# EasyEDA Pro project YanXi_Project.eprj, schematic FlightControlBoard

## Sheets
1 主控: Create Date: 2023-07-10; Page Name: P1; Project Name: KAKUTE_mini; Schematic Name: Schematic1; Update Date: 2023-07-10; Company: 嘉立创EDA; Page Size: A4; Version: V1.0
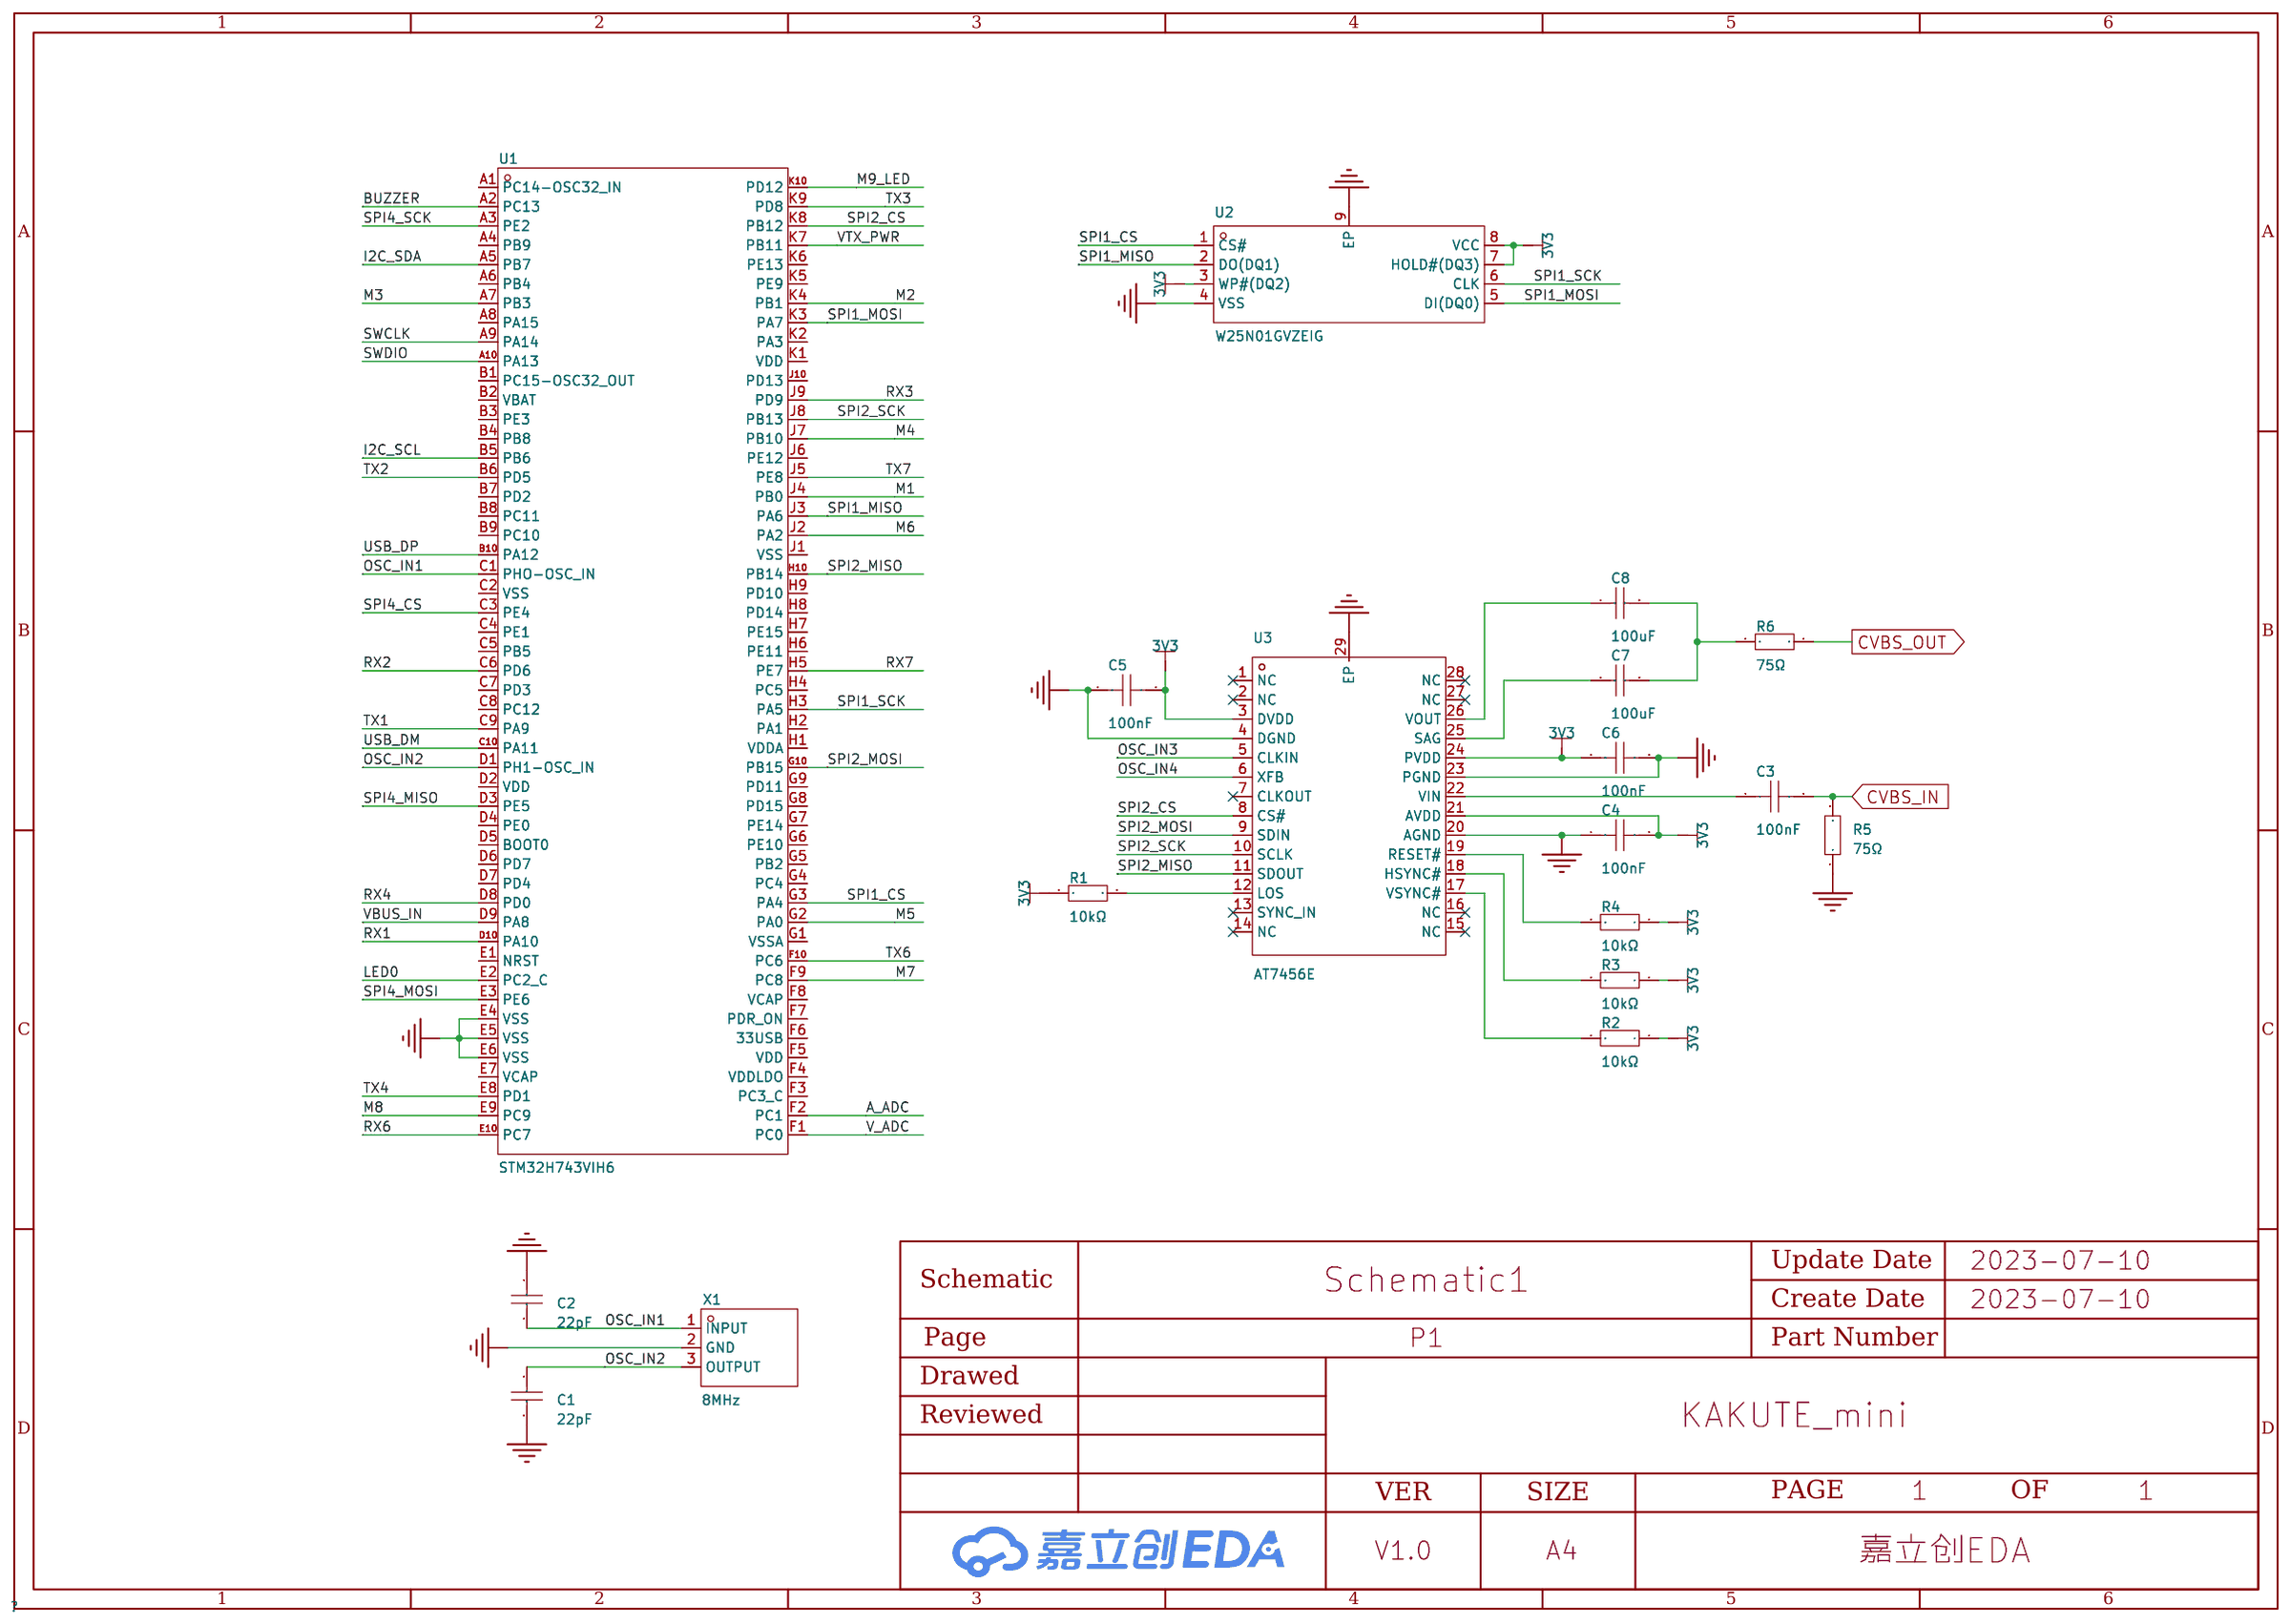
[diagram p3: 主控]
2 接插件: Page Name: P2
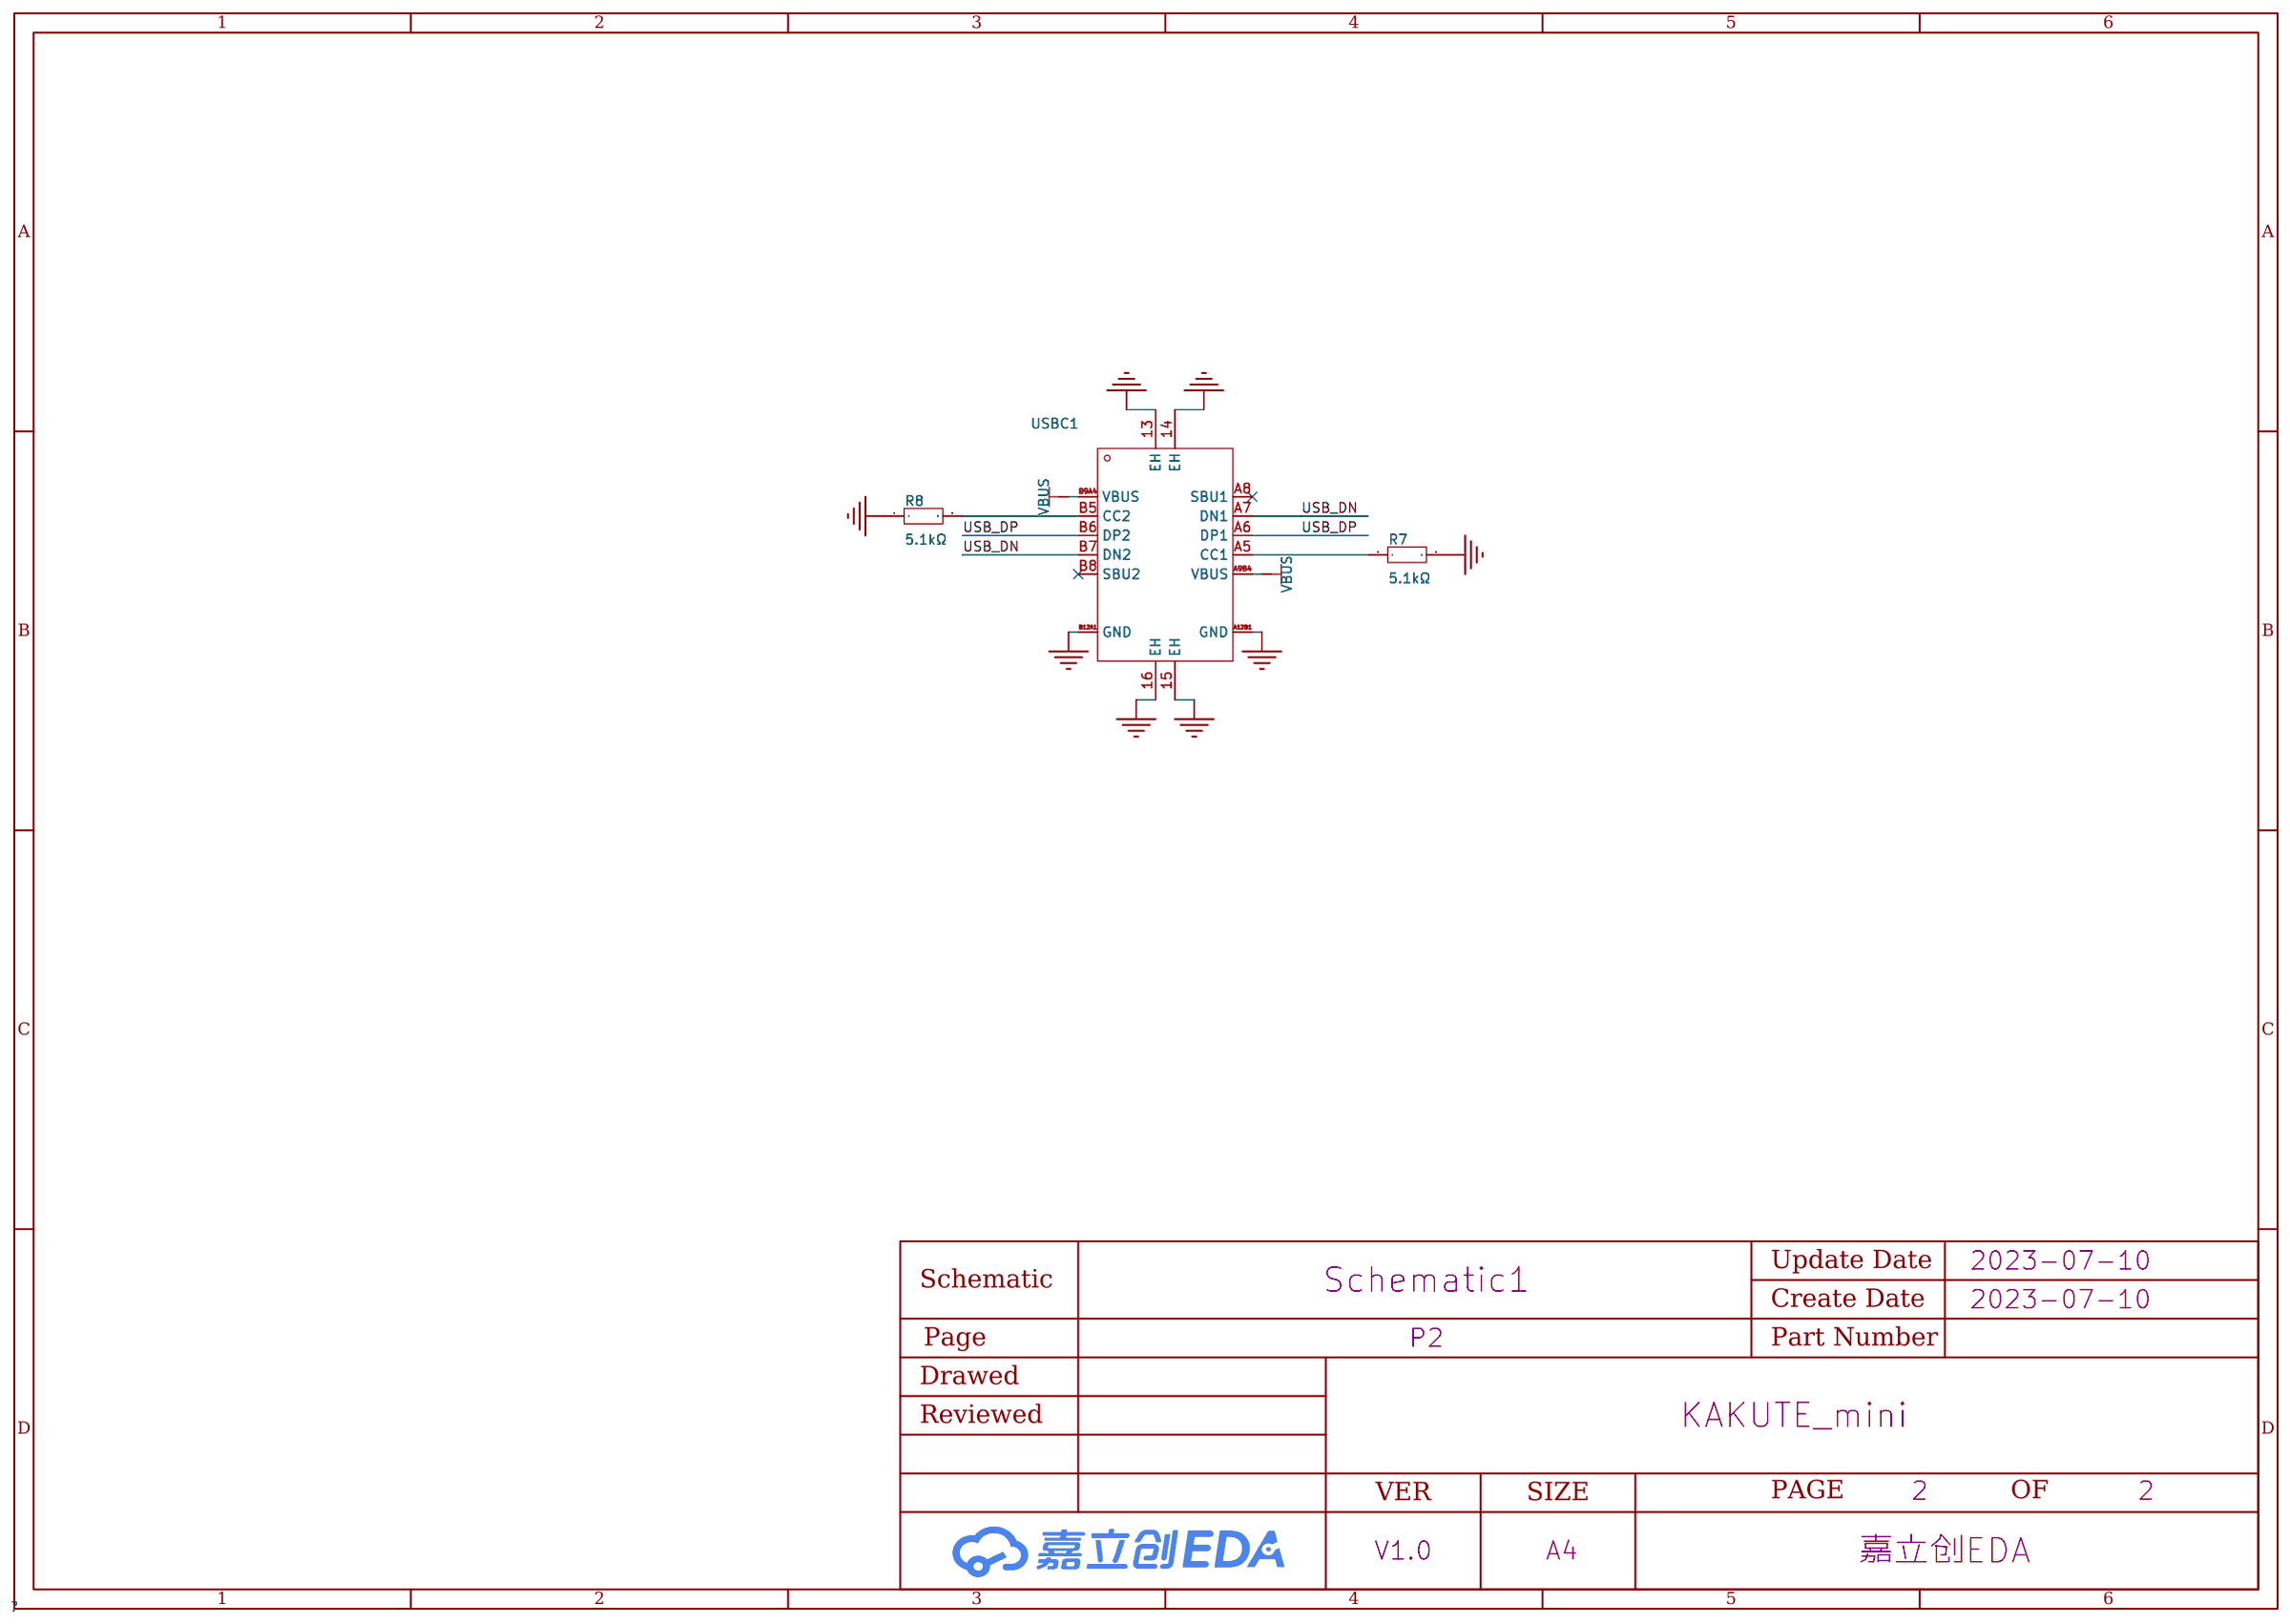
[diagram p4: 接插件]

## Parts
sheet 主控
C1  22pF  [C0402]
C2  22pF  [C0402]
C3  100nF  [C0402]
C4  100nF  [C0402]
C5  100nF  [C0402]
C6  100nF  [C0402]
C7  100uF  [C0805]
C8  100uF  [C0805]
R1  10kΩ  [R0402]
R2  10kΩ  [R0402]
R3  10kΩ  [R0402]
R4  10kΩ  [R0402]
R5  75Ω  [R0402]
R6  75Ω  [R0402]
U1  STM32H743VIH6  [BGA-100_L8.0-W8.0-P0.80-R10-C10-BL]
U2  W25N01GVZEIG  [WSON-8_L8.0-W6.10-P1.27-BL-EP]
U3  AT7456E  [TSSOP-28_L9.7-W4.4-P0.65-LS6.4-BL-EP-2]
X1  8MHz  [OSC-SMD_3P-L3.2-W1.3-P1.20-L]
sheet 接插件
R7  5.1kΩ  [R0402]
R8  5.1kΩ  [R0402]
USBC1  918-418K2024S40000  [USB-C-SMD_TYPE-C-USB-4]

## Library data of the parts
C1 C2 = 0402CG220J500NT: 容值:22pF;精度:±5%;额定电压:50V;材质(温度系数):C0G;; LCSC Part Name: 22pF ±5% 50V; Supplier Part: C1555; Manufacturer: FH(风华); Supplier Footprint: 0402; JLCPCB Part Class: 基础库; Datasheet: https://atta.szlcsc.com/upload/public/pdf/source/20170923/C1555_1506149269156988362.pdf; Supplier: LCSC; Tolerance: ±5%; Voltage Rated: 50V; Temperature Coefficient: C0G
C3-C6 = CL05B104KB54PNC: 容值:100nF;精度:±10%;额定电压:50V;材质(温度系数):X7R;; LCSC Part Name: 100nF ±10% 50V; Supplier Part: C307331; Manufacturer: SAMSUNG(三星); Supplier Footprint: 0402; JLCPCB Part Class: 基础库; Datasheet: https://atta.szlcsc.com/upload/public/pdf/source/20181009/C307331_222F7C870FD3EA5F46F538B483443886.pdf; Supplier: LCSC; Tolerance: ±10%; Voltage Rated: 50V; Temperature Coefficient: X7R
C7 C8 = GRM21BR60J107ME15L: 容值:100uF;精度:±20%;额定电压:6.3V;材质(温度系数):X5R;; LCSC Part Name: 100uF ±20% 6.3V; Supplier Part: C141660; Manufacturer: muRata(村田); Supplier Footprint: 0805; JLCPCB Part Class: Extended Part; Datasheet: https://atta.szlcsc.com/upload/public/pdf/source/20171113/C141660_15105613320671115822.pdf; Supplier: LCSC; Tolerance: ±20%; Voltage Rated: 6.3V; Temperature Coefficient: X5R
R1-R4 = 0402WGF1002TCE: 电阻类型:厚膜电阻;阻值:10kΩ;精度:±1%;功率:62.5mW;; LCSC Part Name: 10kΩ ±1% 62.5mW; Supplier Part: C25744; Manufacturer: UNI-ROYAL(厚声); Supplier Footprint: 0402; JLCPCB Part Class: Basic Part; Datasheet: https://atta.szlcsc.com/upload/public/pdf/source/20200306/C422600_1E6D84923E4A46A82E41ADD87F860B5C.pdf; Supplier: LCSC; Type: 厚膜电阻; Tolerance: ±1%; Power(Watts): 62.5mW; Temperature Coefficient: ±100ppm/℃; Overload Voltage (Max): 50V; Operating Temperature Range: -55℃~+155℃
R5 R6 = 0402WGF750JTCE: 电阻类型:厚膜电阻;阻值:75Ω;精度:±1%;功率:62.5mW;; LCSC Part Name: 75Ω ±1% 62.5mW; Supplier Part: C25133; Manufacturer: UNI-ROYAL(厚声); Supplier Footprint: 0402; JLCPCB Part Class: 基础库; Datasheet: https://atta.szlcsc.com/upload/public/pdf/source/20200306/C422600_1E6D84923E4A46A82E41ADD87F860B5C.pdf; Supplier: LCSC; Type: 厚膜电阻; Tolerance: ±1%; Power(Watts): 62.5mW; Temperature Coefficient: ±100ppm/℃; Overload Voltage (Max): 50V; Operating Temperature Range: -55℃~+155℃
U1 = STM32H743VIH6: 32位Arm Cortex -M7 480MHz mcu,高达2MB的Flash,高达1MB的RAM,46com和模拟接口; Supplier Part: C964146; Manufacturer: ST(意法半导体); Supplier Footprint: TFBGA-100; JLCPCB Part Class: 扩展库; Datasheet: https://atta.szlcsc.com/upload/public/pdf/source/20220307/46489B78091107FB73FE6602EFA9948C.pdf; Supplier: LCSC
U2 = W25N01GVZEIG: 存储器类型:-;存储器构架(格式):-;技术:-;存储器容量:-;时钟频率:-;存储器接口类型:-;; Supplier Part: C907680; Manufacturer: WINBOND(华邦); Supplier Footprint: WSON-8; JLCPCB Part Class: 扩展库; Datasheet: https://atta.szlcsc.com/upload/public/pdf/source/20201021/C907645_0A29D2C383E097D6F46BF0FEEFAA9DEB.pdf; Supplier: LCSC
U3 = AT7456E: 视频字符叠加芯片，跟MAX7456-pin-pin; Supplier Part: C82351; Manufacturer: 杭州中科微; Supplier Footprint: TSSOP-28; JLCPCB Part Class: 扩展库; Datasheet: https://atta.szlcsc.com/upload/public/pdf/source/20180326/C82351_A40539A53E8345C88178541014FDE5FB.pdf; Supplier: LCSC
X1 = CSTNE8M00GH5L000R0: 频率:8MHz;频率公差:±0.07%;频率稳定度:-;; LCSC Part Name: 8MHz ±0.07%; Supplier Part: C882602; Manufacturer: muRata(村田); Supplier Footprint: SMD3213-3P; JLCPCB Part Class: 扩展库; Datasheet: https://atta.szlcsc.com/upload/public/pdf/source/20210726/C882602_740E1448EDBB3C55C7DDB16518B64D07.pdf; Supplier: LCSC; Frequency Tolerance: ±0.07%; Operating Temperature: -40℃~+85℃
R7 R8 = 0402WGF5101TCE: 电阻类型:厚膜电阻;阻值:5.1kΩ;精度:±1%;功率:62.5mW;; LCSC Part Name: 5.1kΩ ±1% 62.5mW; Supplier Part: C25905; Manufacturer: UNI-ROYAL(厚声); Supplier Footprint: 0402; JLCPCB Part Class: 基础库; Datasheet: https://atta.szlcsc.com/upload/public/pdf/source/20200306/C422600_1E6D84923E4A46A82E41ADD87F860B5C.pdf; Supplier: LCSC; Type: 厚膜电阻; Tolerance: ±1%; Power(Watts): 62.5mW; Temperature Coefficient: ±100ppm/℃; Overload Voltage (Max): 50V; Operating Temperature Range: -55℃~+155℃
USBC1 = 918-418K2024S40000: 连接器类型:Type-C;标准:-;公母:母座;触点数量:16;端口数量:1;; LCSC Part Name: Type-C 母座; Supplier Part: C168688; Manufacturer: 精拓金; Supplier Footprint: SMD; JLCPCB Part Class: 扩展库; Datasheet: https://atta.szlcsc.com/upload/public/pdf/source/20210305/C168688_67E9870F07D1BBFDE7A21510679CE418.pdf; Supplier: LCSC; Connector Type: Type-C; Gender: 母座; Number of Contacts: 16; Number of Ports: 1

## Nets
3V3: C4.2 C5.2 C6.1 R1.1 R2.1 R3.1 R4.1 U2.3(WP#(DQ2)) U2.7(HOLD#(DQ3)) U2.8(VCC) U3.3(DVDD) U3.21(AVDD) U3.24(PVDD)
GND: C1.2 C2.2 C4.1 C5.1 C6.2 R5.1 R7.2 R8.1 U1.E4(VSS) U1.E5(VSS) U1.E6(VSS) U2.4(VSS) U2.9(EP) U3.4(DGND) U3.20(AGND) U3.23(PGND) U3.29(EP) USBC1.13(EH) USBC1.14(EH) USBC1.15(EH) USBC1.16(EH) USBC1.A12B1(GND) USBC1.B12A1(GND) X1.2(GND)
VBUS: USBC1.A9B4(VBUS) USBC1.B9A4(VBUS)
VBUS_IN: U1.D9(PA8)
A_ADC: U1.F2(PC1)
BUZZER: U1.A2(PC13)
CVBS_IN: C3.2 R5.2
CVBS_OUT: R6.1
I2C_SCL: U1.B5(PB6)
I2C_SDA: U1.A5(PB7)
LED0: U1.E2(PC2_C)
M1: U1.J4(PB0)
M2: U1.K4(PB1)
M3: U1.A7(PB3)
M4: U1.J7(PB10)
M5: U1.G2(PA0)
M6: U1.J2(PA2)
M7: U1.F9(PC8)
M8: U1.E9(PC9)
M9_LED: U1.K10(PD12)
OSC_IN1: C2.1 U1.C1(PHO-OSC_IN) X1.1(INPUT)
OSC_IN2: C1.1 U1.D1(PH1-OSC_IN) X1.3(OUTPUT)
OSC_IN3: U3.5(CLKIN)
OSC_IN4: U3.6(XFB)
RX1: U1.D10(PA10)
RX2: U1.C6(PD6)
RX3: U1.J9(PD9)
RX4: U1.D8(PD0)
RX6: U1.E10(PC7)
RX7: U1.H5(PE7)
SPI1_CS: U1.G3(PA4) U2.1(CS#)
SPI1_MISO: U1.J3(PA6) U2.2(DO(DQ1))
SPI1_MOSI: U1.K3(PA7) U2.5(DI(DQ0))
SPI1_SCK: U1.H3(PA5) U2.6(CLK)
SPI2_CS: U1.K8(PB12) U3.8(CS#)
SPI2_MISO: U1.H10(PB14) U3.11(SDOUT)
SPI2_MOSI: U1.G10(PB15) U3.9(SDIN)
SPI2_SCK: U1.J8(PB13) U3.10(SCLK)
SPI4_CS: U1.C3(PE4)
SPI4_MISO: U1.D3(PE5)
SPI4_MOSI: U1.E3(PE6)
SPI4_SCK: U1.A3(PE2)
SWCLK: U1.A9(PA14)
SWDIO: U1.A10(PA13)
TX1: U1.C9(PA9)
TX2: U1.B6(PD5)
TX3: U1.K9(PD8)
TX4: U1.E8(PD1)
TX6: U1.F10(PC6)
TX7: U1.J5(PE8)
USB_DM: U1.C10(PA11)
USB_DN: USBC1.A7(DN1) USBC1.B7(DN2)
USB_DP: U1.B10(PA12) USBC1.A6(DP1) USBC1.B6(DP2)
V_ADC: U1.F1(PC0)
VTX_PWR: U1.K7(PB11)
Net-(C3-1): C3.1 U3.22(VIN)
Net-(C7-1): C7.1 U3.25(SAG)
Net-(C7-2): C7.2 C8.2 R6.2
Net-(C8-1): C8.1 U3.26(VOUT)
Net-(R1-2): R1.2 U3.12(LOS)
Net-(R2-2): R2.2 U3.17(VSYNC#)
Net-(R3-2): R3.2 U3.18(HSYNC#)
Net-(R4-2): R4.2 U3.19(RESET#)
Net-(R7-1): R7.1 USBC1.A5(CC1)
Net-(R8-2): R8.2 USBC1.B5(CC2)

Not connected (* = marked no-connect by the designer): U1 A1(PC14-OSC32_IN) A4(PB9) A6(PB4) A8(PA15) B1(PC15-OSC32_OUT) B2(VBAT) B3(PE3) B4(PB8) B7(PD2) B8(PC11) B9(PC10) C2(VSS) C4(PE1) C5(PB5) C7(PD3) C8(PC12) D2(VDD) D4(PE0) D5(BOOT0) D6(PD7) D7(PD4) E1(NRST) E7(VCAP) F3(PC3_C) F4(VDDLDO) F5(VDD) F6(33USB) F7(PDR_ON) F8(VCAP) G1(VSSA) G4(PC4) G5(PB2) G6(PE10) G7(PE14) G8(PD15) G9(PD11) H1(VDDA) H2(PA1) H4(PC5) H6(PE11) H7(PE15) H8(PD14) H9(PD10) J1(VSS) J6(PE12) J10(PD13) K1(VDD) K2(PA3) K5(PE9) K6(PE13); U3 1(NC)* 2(NC)* 7(CLKOUT)* 13(SYNC_IN)* 14(NC)* 15(NC)* 16(NC)* 27(NC)* 28(NC)*; USBC1 A8(SBU1)* B8(SBU2)*
